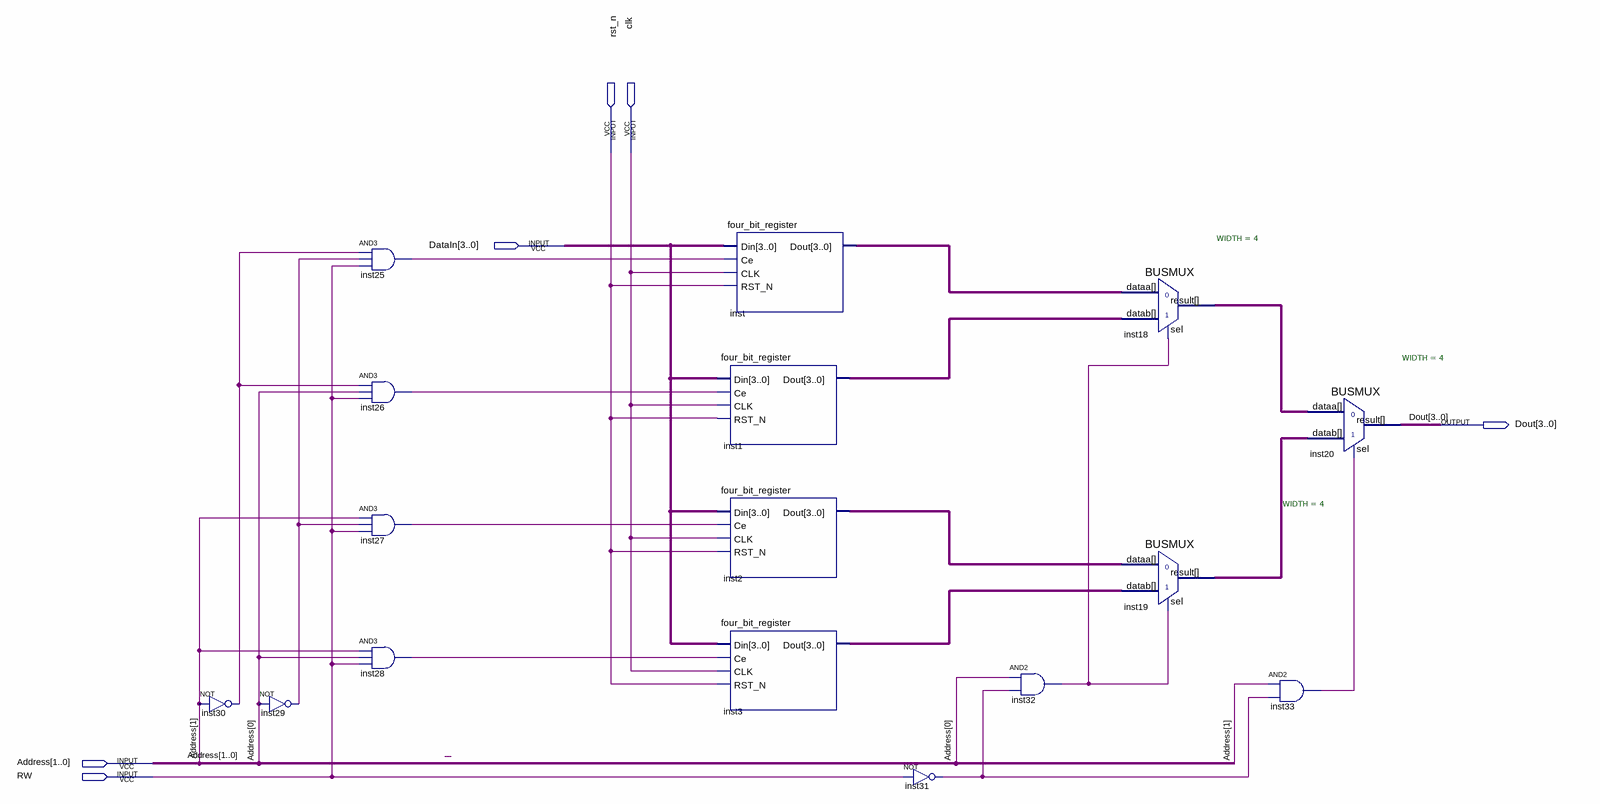
[diagram p0: schematic sheet]
// Quartus schematic fourbit_four_sram.bdf as structural Verilog: 16 symbols, 6 pins
module fourbit_four_sram (
  input  rst_n,
  input  clk,
  input  [3:0] DataIn,
  input  [1:0] Address,
  input  RW,
  output [3:0] Dout
);

  wire inst25_out, inst26_out, inst27_out, inst28_out, inst29_out, inst30_out, inst31_out, inst32_out,
       inst33_out;
  wire [3:0] inst1_dout, inst2_dout, inst3_dout, inst18_result, inst19_result, inst_dout;

  not inst30 (inst30_out, Address[1]);
  not inst29 (inst29_out, Address[0]);
  and inst25 (inst25_out, inst30_out, inst29_out, RW);
  and inst26 (inst26_out, inst30_out, Address[0], RW);
  and inst27 (inst27_out, Address[1], inst29_out, RW);
  and inst28 (inst28_out, Address[1], Address[0], RW);
  four_bit_register inst (.Din(DataIn), .Ce(inst25_out), .CLK(clk), .RST_N(rst_n), .Dout(inst_dout));
  four_bit_register inst1 (.Din(DataIn), .Ce(inst26_out), .CLK(clk), .RST_N(rst_n), .Dout(inst1_dout));
  four_bit_register inst2 (.Din(DataIn), .Ce(inst27_out), .CLK(clk), .RST_N(rst_n), .Dout(inst2_dout));
  four_bit_register inst3 (.Din(DataIn), .Ce(inst28_out), .CLK(clk), .RST_N(rst_n), .Dout(inst3_dout));
  not inst31 (inst31_out, RW);
  and inst32 (inst32_out, Address[0], inst31_out);
  BUSMUX #(.WIDTH(4)) inst18 (.datab(inst1_dout), .sel(inst32_out), .dataa(inst_dout), .result(inst18_result));
  BUSMUX #(.WIDTH(4)) inst19 (.datab(inst3_dout), .sel(inst32_out), .dataa(inst2_dout), .result(inst19_result));
  and inst33 (inst33_out, Address[1], inst31_out);
  BUSMUX #(.WIDTH(4)) inst20 (.datab(inst19_result), .sel(inst33_out), .dataa(inst18_result), .result(Dout));
endmodule
